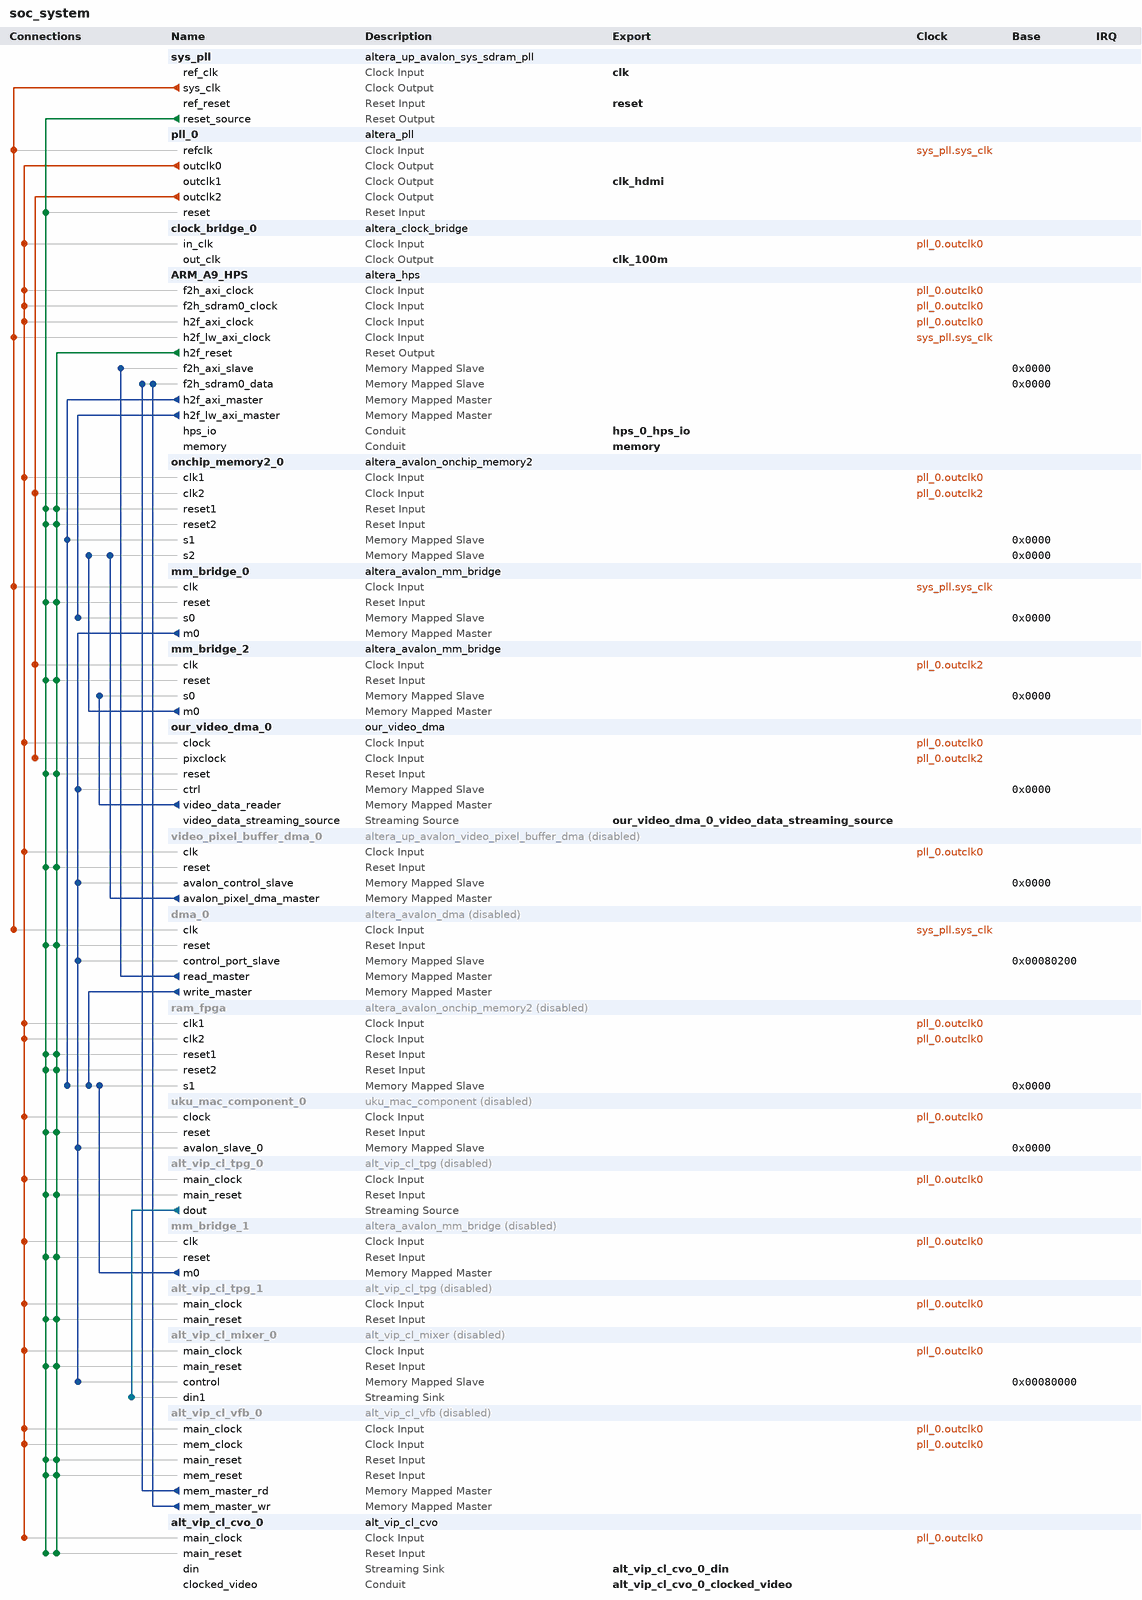
[diagram p0: system contents]
# Platform Designer (Qsys) system soc_system, Cyclone V 5CSEBA6U23I7
# Parameters at their usual value, and those the tool derives, are not listed.
package require -exact qsys 20.1
create_system soc_system
set_project_property DEVICE_FAMILY {Cyclone V}
set_project_property DEVICE 5CSEBA6U23I7

add_instance sys_pll altera_up_avalon_sys_sdram_pll 18.0
set_instance_parameter_value sys_pll CV_boards DE10-Nano
set_instance_parameter_value sys_pll gui_outclk 50.0
set_instance_parameter_value sys_pll gui_refclk 50.0

add_instance pll_0 altera_pll 20.1
set_instance_parameter_value pll_0 gui_actual_output_clock_frequency1 {107.692307 MHz}
set_instance_parameter_value pll_0 gui_device_speed_grade 1
set_instance_parameter_value pll_0 gui_number_of_clocks 3
set_instance_parameter_value pll_0 gui_operation_mode direct
set_instance_parameter_value pll_0 gui_output_clock_frequency0 130.0
set_instance_parameter_value pll_0 gui_output_clock_frequency1 65.0
set_instance_parameter_value pll_0 gui_output_clock_frequency2 65.0
set_instance_parameter_value pll_0 gui_pll_mode {Integer-N PLL}
set_instance_parameter_value pll_0 gui_reference_clock_frequency 50.0
set_instance_parameter_value pll_0 gui_use_locked false

add_instance clock_bridge_0 altera_clock_bridge 20.1
set_instance_parameter_value clock_bridge_0 DERIVED_CLOCK_RATE 130000000
set_instance_parameter_value clock_bridge_0 EXPLICIT_CLOCK_RATE 0

add_instance ARM_A9_HPS altera_hps 20.1
set_instance_parameter_value ARM_A9_HPS EMAC1_Mode RGMII
set_instance_parameter_value ARM_A9_HPS EMAC1_PinMuxing {HPS I/O Set 0}
set_instance_parameter_value ARM_A9_HPS F2SCLK_COLDRST_Enable false
set_instance_parameter_value ARM_A9_HPS F2SCLK_DBGRST_Enable false
set_instance_parameter_value ARM_A9_HPS F2SCLK_WARMRST_Enable false
set_instance_parameter_value ARM_A9_HPS F2SDRAM_Type {Avalon-MM Bidirectional}
set_instance_parameter_value ARM_A9_HPS F2SDRAM_Width 128
set_instance_parameter_value ARM_A9_HPS F2SINTERRUPT_Enable true
set_instance_parameter_value ARM_A9_HPS F2S_Width 1
set_instance_parameter_value ARM_A9_HPS FPGA_PERIPHERAL_OUTPUT_CLOCK_FREQ_EMAC0_GTX_CLK 100
set_instance_parameter_value ARM_A9_HPS FPGA_PERIPHERAL_OUTPUT_CLOCK_FREQ_EMAC0_MD_CLK 100.0
set_instance_parameter_value ARM_A9_HPS FPGA_PERIPHERAL_OUTPUT_CLOCK_FREQ_EMAC1_GTX_CLK 100
set_instance_parameter_value ARM_A9_HPS FPGA_PERIPHERAL_OUTPUT_CLOCK_FREQ_EMAC1_MD_CLK 100.0
set_instance_parameter_value ARM_A9_HPS HPS_PROTOCOL DDR3
set_instance_parameter_value ARM_A9_HPS I2C0_Mode I2C
set_instance_parameter_value ARM_A9_HPS I2C0_PinMuxing {HPS I/O Set 0}
set_instance_parameter_value ARM_A9_HPS I2C1_Mode I2C
set_instance_parameter_value ARM_A9_HPS I2C1_PinMuxing {HPS I/O Set 0}
set_instance_parameter_value ARM_A9_HPS LWH2F_Enable true
set_instance_parameter_value ARM_A9_HPS MEM_BANKADDR_WIDTH 3
set_instance_parameter_value ARM_A9_HPS MEM_CLK_FREQ 400.0
set_instance_parameter_value ARM_A9_HPS MEM_COL_ADDR_WIDTH 10
set_instance_parameter_value ARM_A9_HPS MEM_DQ_WIDTH 32
set_instance_parameter_value ARM_A9_HPS MEM_DRV_STR RZQ/6
set_instance_parameter_value ARM_A9_HPS MEM_ROW_ADDR_WIDTH 15
set_instance_parameter_value ARM_A9_HPS MEM_RTT_NOM RZQ/6
set_instance_parameter_value ARM_A9_HPS MEM_RTT_WR {Dynamic ODT off}
set_instance_parameter_value ARM_A9_HPS MEM_TCL 7
set_instance_parameter_value ARM_A9_HPS MEM_TFAW_NS 37.5
set_instance_parameter_value ARM_A9_HPS MEM_TRAS_NS 35.0
set_instance_parameter_value ARM_A9_HPS MEM_TRCD_NS 13.75
set_instance_parameter_value ARM_A9_HPS MEM_TRFC_NS 300.0
set_instance_parameter_value ARM_A9_HPS MEM_TRP_NS 13.75
set_instance_parameter_value ARM_A9_HPS MEM_VENDOR Other
set_instance_parameter_value ARM_A9_HPS MEM_WTCL 7
set_instance_parameter_value ARM_A9_HPS QSPI_Mode N/A
set_instance_parameter_value ARM_A9_HPS QSPI_PinMuxing Unused
set_instance_parameter_value ARM_A9_HPS REF_CLK_FREQ 25.0
set_instance_parameter_value ARM_A9_HPS S2FCLK_USER2CLK 4
set_instance_parameter_value ARM_A9_HPS S2F_Width 1
set_instance_parameter_value ARM_A9_HPS SDIO_Mode {4-bit Data}
set_instance_parameter_value ARM_A9_HPS SDIO_PinMuxing {HPS I/O Set 0}
set_instance_parameter_value ARM_A9_HPS SPIM1_Mode {Single Slave Select}
set_instance_parameter_value ARM_A9_HPS SPIM1_PinMuxing {HPS I/O Set 0}
set_instance_parameter_value ARM_A9_HPS STM_Enable false
set_instance_parameter_value ARM_A9_HPS TIMING_BOARD_AC_SKEW 0.02
set_instance_parameter_value ARM_A9_HPS TIMING_BOARD_AC_TO_CK_SKEW 0.0
set_instance_parameter_value ARM_A9_HPS TIMING_BOARD_DQ_TO_DQS_SKEW 0.0
set_instance_parameter_value ARM_A9_HPS TIMING_BOARD_MAX_CK_DELAY 0.6
set_instance_parameter_value ARM_A9_HPS TIMING_BOARD_MAX_DQS_DELAY 0.6
set_instance_parameter_value ARM_A9_HPS TIMING_BOARD_SKEW_BETWEEN_DQS 0.02
set_instance_parameter_value ARM_A9_HPS TIMING_BOARD_SKEW_CKDQS_DIMM_MAX 0.01
set_instance_parameter_value ARM_A9_HPS TIMING_BOARD_SKEW_CKDQS_DIMM_MIN -0.01
set_instance_parameter_value ARM_A9_HPS TIMING_BOARD_SKEW_WITHIN_DQS 0.02
set_instance_parameter_value ARM_A9_HPS TIMING_TDH 125
set_instance_parameter_value ARM_A9_HPS TIMING_TDQSCK 400
set_instance_parameter_value ARM_A9_HPS TIMING_TDQSQ 120
set_instance_parameter_value ARM_A9_HPS TIMING_TDS 50
set_instance_parameter_value ARM_A9_HPS TIMING_TIH 250
set_instance_parameter_value ARM_A9_HPS TIMING_TIS 175
set_instance_parameter_value ARM_A9_HPS TIMING_TQSH 0.38
set_instance_parameter_value ARM_A9_HPS UART0_Mode {No Flow Control}
set_instance_parameter_value ARM_A9_HPS UART0_PinMuxing {HPS I/O Set 0}
set_instance_parameter_value ARM_A9_HPS USB1_Mode SDR
set_instance_parameter_value ARM_A9_HPS USB1_PinMuxing {HPS I/O Set 0}
set_instance_parameter_value ARM_A9_HPS desired_cfg_clk_mhz 100.0
set_instance_parameter_value ARM_A9_HPS desired_qspi_clk_mhz 370.0

add_instance onchip_memory2_0 altera_avalon_onchip_memory2 20.1
set_instance_parameter_value onchip_memory2_0 dataWidth 32
set_instance_parameter_value onchip_memory2_0 dualPort true
set_instance_parameter_value onchip_memory2_0 initMemContent true
set_instance_parameter_value onchip_memory2_0 initializationFileName onchip_mem.hex
set_instance_parameter_value onchip_memory2_0 memorySize 24576

add_instance mm_bridge_0 altera_avalon_mm_bridge 20.1
set_instance_parameter_value mm_bridge_0 ADDRESS_UNITS SYMBOLS
set_instance_parameter_value mm_bridge_0 ADDRESS_WIDTH 10
set_instance_parameter_value mm_bridge_0 DATA_WIDTH 32
set_instance_parameter_value mm_bridge_0 MAX_PENDING_RESPONSES 4
set_instance_parameter_value mm_bridge_0 USE_AUTO_ADDRESS_WIDTH 1

add_instance mm_bridge_2 altera_avalon_mm_bridge 20.1
set_instance_parameter_value mm_bridge_2 ADDRESS_UNITS WORDS
set_instance_parameter_value mm_bridge_2 ADDRESS_WIDTH 32
set_instance_parameter_value mm_bridge_2 DATA_WIDTH 32
set_instance_parameter_value mm_bridge_2 MAX_PENDING_RESPONSES 1
set_instance_parameter_value mm_bridge_2 PIPELINE_COMMAND 0
set_instance_parameter_value mm_bridge_2 PIPELINE_RESPONSE 0
set_instance_parameter_value mm_bridge_2 USE_AUTO_ADDRESS_WIDTH 1

add_instance our_video_dma_0 our_video_dma 1.0
set_instance_parameter_value our_video_dma_0 VIDEO_H 768
set_instance_parameter_value our_video_dma_0 VIDEO_W 1025

add_instance video_pixel_buffer_dma_0 altera_up_avalon_video_pixel_buffer_dma 18.0
set_instance_property video_pixel_buffer_dma_0 ENABLED false
set_instance_parameter_value video_pixel_buffer_dma_0 addr_mode Consecutive
set_instance_parameter_value video_pixel_buffer_dma_0 back_start_address 0
set_instance_parameter_value video_pixel_buffer_dma_0 color_space {24-bit RGB}
set_instance_parameter_value video_pixel_buffer_dma_0 image_height 768
set_instance_parameter_value video_pixel_buffer_dma_0 image_width 1024
set_instance_parameter_value video_pixel_buffer_dma_0 start_address 0

add_instance dma_0 altera_avalon_dma 20.1
set_instance_property dma_0 ENABLED false
set_instance_parameter_value dma_0 allowByteTransactions false
set_instance_parameter_value dma_0 allowDoubleWordTransactions false
set_instance_parameter_value dma_0 allowHalfWordTransactions false
set_instance_parameter_value dma_0 allowQuadWordTransactions false
set_instance_parameter_value dma_0 burstEnable false
set_instance_parameter_value dma_0 fifoDepth 32
set_instance_parameter_value dma_0 maxBurstSize 128
set_instance_parameter_value dma_0 minimumDmaTransactionRegisterWidth 16

add_instance ram_fpga altera_avalon_onchip_memory2 20.1
set_instance_property ram_fpga ENABLED false
set_instance_parameter_value ram_fpga dataWidth 32
set_instance_parameter_value ram_fpga dualPort true
set_instance_parameter_value ram_fpga initMemContent true
set_instance_parameter_value ram_fpga initializationFileName onchip_mem.hex
set_instance_parameter_value ram_fpga memorySize 100000

add_instance uku_mac_component_0 uku_mac_component 1.0
set_instance_property uku_mac_component_0 ENABLED false

add_instance alt_vip_cl_tpg_0 alt_vip_cl_tpg 20.1
set_instance_property alt_vip_cl_tpg_0 ENABLED false
set_instance_parameter_value alt_vip_cl_tpg_0 BITS_PER_SYMBOL 8
set_instance_parameter_value alt_vip_cl_tpg_0 COLOR_PLANES_ARE_IN_PARALLEL 1
set_instance_parameter_value alt_vip_cl_tpg_0 COLOR_SPACE_0 RGB_444
set_instance_parameter_value alt_vip_cl_tpg_0 COLOR_SPACE_1 RGB_444
set_instance_parameter_value alt_vip_cl_tpg_0 COLOR_SPACE_2 RGB_444
set_instance_parameter_value alt_vip_cl_tpg_0 COLOR_SPACE_3 RGB_444
set_instance_parameter_value alt_vip_cl_tpg_0 COLOR_SPACE_4 RGB_444
set_instance_parameter_value alt_vip_cl_tpg_0 COLOR_SPACE_5 RGB_444
set_instance_parameter_value alt_vip_cl_tpg_0 COLOR_SPACE_6 RGB_444
set_instance_parameter_value alt_vip_cl_tpg_0 COLOR_SPACE_7 RGB_444
set_instance_parameter_value alt_vip_cl_tpg_0 DEFAULT_BOARDER 1
set_instance_parameter_value alt_vip_cl_tpg_0 FAMILY {Cyclone V}
set_instance_parameter_value alt_vip_cl_tpg_0 INTERLACING PROGRESSIVE
set_instance_parameter_value alt_vip_cl_tpg_0 LIMITED_READBACK 0
set_instance_parameter_value alt_vip_cl_tpg_0 MAX_HEIGHT 768
set_instance_parameter_value alt_vip_cl_tpg_0 MAX_WIDTH 1024
set_instance_parameter_value alt_vip_cl_tpg_0 NUMBER_OF_COLOR_PLANES 2
set_instance_parameter_value alt_vip_cl_tpg_0 NUM_CORES 1
set_instance_parameter_value alt_vip_cl_tpg_0 OUTPUT_FORMAT 4.4.4
set_instance_parameter_value alt_vip_cl_tpg_0 PATTERN_0 colorbars
set_instance_parameter_value alt_vip_cl_tpg_0 PATTERN_1 colorbars
set_instance_parameter_value alt_vip_cl_tpg_0 PATTERN_2 colorbars
set_instance_parameter_value alt_vip_cl_tpg_0 PATTERN_3 colorbars
set_instance_parameter_value alt_vip_cl_tpg_0 PATTERN_4 colorbars
set_instance_parameter_value alt_vip_cl_tpg_0 PATTERN_5 colorbars
set_instance_parameter_value alt_vip_cl_tpg_0 PATTERN_6 colorbars
set_instance_parameter_value alt_vip_cl_tpg_0 PATTERN_7 colorbars
set_instance_parameter_value alt_vip_cl_tpg_0 PIPELINE_READY 0
set_instance_parameter_value alt_vip_cl_tpg_0 PIXELS_IN_PARALLEL 1
set_instance_parameter_value alt_vip_cl_tpg_0 RUNTIME_CONTROL 0
set_instance_parameter_value alt_vip_cl_tpg_0 UNIFORM_VALUE_BCR 16
set_instance_parameter_value alt_vip_cl_tpg_0 UNIFORM_VALUE_GCB 16
set_instance_parameter_value alt_vip_cl_tpg_0 UNIFORM_VALUE_RY 16

add_instance mm_bridge_1 altera_avalon_mm_bridge 20.1
set_instance_property mm_bridge_1 ENABLED false
set_instance_parameter_value mm_bridge_1 ADDRESS_UNITS SYMBOLS
set_instance_parameter_value mm_bridge_1 ADDRESS_WIDTH 32
set_instance_parameter_value mm_bridge_1 DATA_WIDTH 32
set_instance_parameter_value mm_bridge_1 MAX_PENDING_RESPONSES 4
set_instance_parameter_value mm_bridge_1 USE_AUTO_ADDRESS_WIDTH 0

add_instance alt_vip_cl_tpg_1 alt_vip_cl_tpg 20.1
set_instance_property alt_vip_cl_tpg_1 ENABLED false
set_instance_parameter_value alt_vip_cl_tpg_1 BITS_PER_SYMBOL 8
set_instance_parameter_value alt_vip_cl_tpg_1 COLOR_PLANES_ARE_IN_PARALLEL 1
set_instance_parameter_value alt_vip_cl_tpg_1 COLOR_SPACE_0 RGB_444
set_instance_parameter_value alt_vip_cl_tpg_1 COLOR_SPACE_1 RGB_444
set_instance_parameter_value alt_vip_cl_tpg_1 COLOR_SPACE_2 RGB_444
set_instance_parameter_value alt_vip_cl_tpg_1 COLOR_SPACE_3 RGB_444
set_instance_parameter_value alt_vip_cl_tpg_1 COLOR_SPACE_4 RGB_444
set_instance_parameter_value alt_vip_cl_tpg_1 COLOR_SPACE_5 RGB_444
set_instance_parameter_value alt_vip_cl_tpg_1 COLOR_SPACE_6 RGB_444
set_instance_parameter_value alt_vip_cl_tpg_1 COLOR_SPACE_7 RGB_444
set_instance_parameter_value alt_vip_cl_tpg_1 DEFAULT_BOARDER 1
set_instance_parameter_value alt_vip_cl_tpg_1 FAMILY {Cyclone V}
set_instance_parameter_value alt_vip_cl_tpg_1 INTERLACING PROGRESSIVE
set_instance_parameter_value alt_vip_cl_tpg_1 LIMITED_READBACK 0
set_instance_parameter_value alt_vip_cl_tpg_1 MAX_HEIGHT 100
set_instance_parameter_value alt_vip_cl_tpg_1 MAX_WIDTH 200
set_instance_parameter_value alt_vip_cl_tpg_1 NUMBER_OF_COLOR_PLANES 2
set_instance_parameter_value alt_vip_cl_tpg_1 NUM_CORES 1
set_instance_parameter_value alt_vip_cl_tpg_1 OUTPUT_FORMAT 4.4.4
set_instance_parameter_value alt_vip_cl_tpg_1 PATTERN_0 uniform
set_instance_parameter_value alt_vip_cl_tpg_1 PATTERN_1 colorbars
set_instance_parameter_value alt_vip_cl_tpg_1 PATTERN_2 colorbars
set_instance_parameter_value alt_vip_cl_tpg_1 PATTERN_3 colorbars
set_instance_parameter_value alt_vip_cl_tpg_1 PATTERN_4 colorbars
set_instance_parameter_value alt_vip_cl_tpg_1 PATTERN_5 colorbars
set_instance_parameter_value alt_vip_cl_tpg_1 PATTERN_6 colorbars
set_instance_parameter_value alt_vip_cl_tpg_1 PATTERN_7 colorbars
set_instance_parameter_value alt_vip_cl_tpg_1 PIPELINE_READY 0
set_instance_parameter_value alt_vip_cl_tpg_1 PIXELS_IN_PARALLEL 1
set_instance_parameter_value alt_vip_cl_tpg_1 RUNTIME_CONTROL 0
set_instance_parameter_value alt_vip_cl_tpg_1 UNIFORM_VALUE_BCR 120
set_instance_parameter_value alt_vip_cl_tpg_1 UNIFORM_VALUE_GCB 255
set_instance_parameter_value alt_vip_cl_tpg_1 UNIFORM_VALUE_RY 8

add_instance alt_vip_cl_mixer_0 alt_vip_cl_mixer 20.1
set_instance_property alt_vip_cl_mixer_0 ENABLED false
set_instance_parameter_value alt_vip_cl_mixer_0 ALPHA_ENABLE 0
set_instance_parameter_value alt_vip_cl_mixer_0 ALPHA_STREAM_ENABLE0 0
set_instance_parameter_value alt_vip_cl_mixer_0 ALPHA_STREAM_ENABLE1 0
set_instance_parameter_value alt_vip_cl_mixer_0 ALPHA_STREAM_ENABLE10 0
set_instance_parameter_value alt_vip_cl_mixer_0 ALPHA_STREAM_ENABLE11 0
set_instance_parameter_value alt_vip_cl_mixer_0 ALPHA_STREAM_ENABLE12 0
set_instance_parameter_value alt_vip_cl_mixer_0 ALPHA_STREAM_ENABLE13 0
set_instance_parameter_value alt_vip_cl_mixer_0 ALPHA_STREAM_ENABLE14 0
set_instance_parameter_value alt_vip_cl_mixer_0 ALPHA_STREAM_ENABLE15 0
set_instance_parameter_value alt_vip_cl_mixer_0 ALPHA_STREAM_ENABLE16 0
set_instance_parameter_value alt_vip_cl_mixer_0 ALPHA_STREAM_ENABLE17 0
set_instance_parameter_value alt_vip_cl_mixer_0 ALPHA_STREAM_ENABLE18 0
set_instance_parameter_value alt_vip_cl_mixer_0 ALPHA_STREAM_ENABLE19 0
set_instance_parameter_value alt_vip_cl_mixer_0 ALPHA_STREAM_ENABLE2 0
set_instance_parameter_value alt_vip_cl_mixer_0 ALPHA_STREAM_ENABLE3 0
set_instance_parameter_value alt_vip_cl_mixer_0 ALPHA_STREAM_ENABLE4 0
set_instance_parameter_value alt_vip_cl_mixer_0 ALPHA_STREAM_ENABLE5 0
set_instance_parameter_value alt_vip_cl_mixer_0 ALPHA_STREAM_ENABLE6 0
set_instance_parameter_value alt_vip_cl_mixer_0 ALPHA_STREAM_ENABLE7 0
set_instance_parameter_value alt_vip_cl_mixer_0 ALPHA_STREAM_ENABLE8 0
set_instance_parameter_value alt_vip_cl_mixer_0 ALPHA_STREAM_ENABLE9 0
set_instance_parameter_value alt_vip_cl_mixer_0 BITS_PER_SYMBOL 8
set_instance_parameter_value alt_vip_cl_mixer_0 COLOR_PLANES_ARE_IN_PARALLEL 1
set_instance_parameter_value alt_vip_cl_mixer_0 COLOR_SPACE RGB
set_instance_parameter_value alt_vip_cl_mixer_0 DATA_PIPELINE_STAGES 0
set_instance_parameter_value alt_vip_cl_mixer_0 FAMILY {Cyclone V}
set_instance_parameter_value alt_vip_cl_mixer_0 IS_422 1
set_instance_parameter_value alt_vip_cl_mixer_0 LAYER_POSITION_ENABLE 0
set_instance_parameter_value alt_vip_cl_mixer_0 LIMITED_READBACK 0
set_instance_parameter_value alt_vip_cl_mixer_0 LOW_LATENCY_MODE 0
set_instance_parameter_value alt_vip_cl_mixer_0 MAX_HEIGHT 768
set_instance_parameter_value alt_vip_cl_mixer_0 MAX_WIDTH 1024
set_instance_parameter_value alt_vip_cl_mixer_0 NO_OF_INPUTS 2
set_instance_parameter_value alt_vip_cl_mixer_0 NUMBER_OF_COLOR_PLANES 2
set_instance_parameter_value alt_vip_cl_mixer_0 PATTERN uniform
set_instance_parameter_value alt_vip_cl_mixer_0 PIPELINE_READY 0
set_instance_parameter_value alt_vip_cl_mixer_0 PIXELS_IN_PARALLEL 1
set_instance_parameter_value alt_vip_cl_mixer_0 UNIFORM_VALUE_BCR 30
set_instance_parameter_value alt_vip_cl_mixer_0 UNIFORM_VALUE_GCB 30
set_instance_parameter_value alt_vip_cl_mixer_0 UNIFORM_VALUE_RY 200
set_instance_parameter_value alt_vip_cl_mixer_0 USER_PACKET_FIFO_DEPTH 0
set_instance_parameter_value alt_vip_cl_mixer_0 USER_PACKET_SUPPORT DISCARD

add_instance alt_vip_cl_vfb_0 alt_vip_cl_vfb 20.1
set_instance_property alt_vip_cl_vfb_0 ENABLED false
set_instance_parameter_value alt_vip_cl_vfb_0 CLOCKS_ARE_SEPARATE 1
set_instance_parameter_value alt_vip_cl_vfb_0 DROP_FRAMES 1
set_instance_parameter_value alt_vip_cl_vfb_0 DROP_INVALID_FIELDS 1
set_instance_parameter_value alt_vip_cl_vfb_0 DROP_REPEAT_USER 0
set_instance_parameter_value alt_vip_cl_vfb_0 IS_FRAME_READER 0
set_instance_parameter_value alt_vip_cl_vfb_0 LINE_BASED_BUFFERING 0
set_instance_parameter_value alt_vip_cl_vfb_0 MAX_HEIGHT 1080
set_instance_parameter_value alt_vip_cl_vfb_0 MAX_WIDTH 1920
set_instance_parameter_value alt_vip_cl_vfb_0 MEM_BASE_ADDR 553648128
set_instance_parameter_value alt_vip_cl_vfb_0 MEM_BUFFER_OFFSET 16777216
set_instance_parameter_value alt_vip_cl_vfb_0 MEM_PORT_WIDTH 128
set_instance_parameter_value alt_vip_cl_vfb_0 PRIORITIZE_FMAX 0
set_instance_parameter_value alt_vip_cl_vfb_0 READER_RUNTIME_CONTROL 0
set_instance_parameter_value alt_vip_cl_vfb_0 READ_FIFO_DEPTH 512
set_instance_parameter_value alt_vip_cl_vfb_0 USER_PACKETS_MAX_STORAGE 1
set_instance_parameter_value alt_vip_cl_vfb_0 USE_BUFFER_OFFSET 0
set_instance_parameter_value alt_vip_cl_vfb_0 WRITE_BURST_TARGET 32
set_instance_parameter_value alt_vip_cl_vfb_0 WRITE_FIFO_DEPTH 512

add_instance alt_vip_cl_cvo_0 alt_vip_cl_cvo 20.1
set_instance_parameter_value alt_vip_cl_cvo_0 ACCEPT_COLOURS_IN_SEQ 0
set_instance_parameter_value alt_vip_cl_cvo_0 ACCEPT_SYNC 0
set_instance_parameter_value alt_vip_cl_cvo_0 ANC_LINE 0
set_instance_parameter_value alt_vip_cl_cvo_0 AP_LINE 0
set_instance_parameter_value alt_vip_cl_cvo_0 BPS 8
set_instance_parameter_value alt_vip_cl_cvo_0 CLOCKS_ARE_SAME 0
set_instance_parameter_value alt_vip_cl_cvo_0 COLOUR_PLANES_ARE_IN_PARALLEL 1
set_instance_parameter_value alt_vip_cl_cvo_0 CONTEXT_WIDTH 8
set_instance_parameter_value alt_vip_cl_cvo_0 COUNT_STEP_IS_PIP_VALUE 0
set_instance_parameter_value alt_vip_cl_cvo_0 DST_WIDTH 8
set_instance_parameter_value alt_vip_cl_cvo_0 FIELD0_ANC_LINE 0
set_instance_parameter_value alt_vip_cl_cvo_0 FIELD0_V_BACK_PORCH 0
set_instance_parameter_value alt_vip_cl_cvo_0 FIELD0_V_BLANK 0
set_instance_parameter_value alt_vip_cl_cvo_0 FIELD0_V_FRONT_PORCH 0
set_instance_parameter_value alt_vip_cl_cvo_0 FIELD0_V_RISING_EDGE 0
set_instance_parameter_value alt_vip_cl_cvo_0 FIELD0_V_SYNC_LENGTH 0
set_instance_parameter_value alt_vip_cl_cvo_0 FIFO_DEPTH 4000
set_instance_parameter_value alt_vip_cl_cvo_0 F_FALLING_EDGE 0
set_instance_parameter_value alt_vip_cl_cvo_0 F_RISING_EDGE 0
set_instance_parameter_value alt_vip_cl_cvo_0 GENERATE_SYNC 0
set_instance_parameter_value alt_vip_cl_cvo_0 H_ACTIVE_PIXELS 1024
set_instance_parameter_value alt_vip_cl_cvo_0 H_BACK_PORCH 160
set_instance_parameter_value alt_vip_cl_cvo_0 H_BLANK 0
set_instance_parameter_value alt_vip_cl_cvo_0 H_FRONT_PORCH 24
set_instance_parameter_value alt_vip_cl_cvo_0 H_SYNC_LENGTH 136
set_instance_parameter_value alt_vip_cl_cvo_0 INTERLACED 0
set_instance_parameter_value alt_vip_cl_cvo_0 LOW_LATENCY 0
set_instance_parameter_value alt_vip_cl_cvo_0 NO_OF_CHANNELS 1
set_instance_parameter_value alt_vip_cl_cvo_0 NO_OF_MODES 1
set_instance_parameter_value alt_vip_cl_cvo_0 NUMBER_OF_COLOUR_PLANES 3
set_instance_parameter_value alt_vip_cl_cvo_0 PIXELS_IN_PARALLEL 1
set_instance_parameter_value alt_vip_cl_cvo_0 SRC_WIDTH 8
set_instance_parameter_value alt_vip_cl_cvo_0 STD_WIDTH 1
set_instance_parameter_value alt_vip_cl_cvo_0 TASK_WIDTH 8
set_instance_parameter_value alt_vip_cl_cvo_0 THRESHOLD 3999
set_instance_parameter_value alt_vip_cl_cvo_0 USE_CONTROL 0
set_instance_parameter_value alt_vip_cl_cvo_0 USE_EMBEDDED_SYNCS 0
set_instance_parameter_value alt_vip_cl_cvo_0 V_ACTIVE_LINES 768
set_instance_parameter_value alt_vip_cl_cvo_0 V_BACK_PORCH 29
set_instance_parameter_value alt_vip_cl_cvo_0 V_BLANK 0
set_instance_parameter_value alt_vip_cl_cvo_0 V_FRONT_PORCH 3
set_instance_parameter_value alt_vip_cl_cvo_0 V_SYNC_LENGTH 6

# connections
add_connection pll_0.outclk0 alt_vip_cl_cvo_0.main_clock clock
add_connection pll_0.outclk0 alt_vip_cl_mixer_0.main_clock clock
add_connection pll_0.outclk0 alt_vip_cl_tpg_0.main_clock clock
add_connection pll_0.outclk0 alt_vip_cl_tpg_1.main_clock clock
add_connection pll_0.outclk0 alt_vip_cl_vfb_0.main_clock clock
add_connection pll_0.outclk0 alt_vip_cl_vfb_0.mem_clock clock
add_connection pll_0.outclk0 ARM_A9_HPS.f2h_axi_clock clock
add_connection pll_0.outclk0 ARM_A9_HPS.f2h_sdram0_clock clock
add_connection pll_0.outclk0 ARM_A9_HPS.h2f_axi_clock clock
add_connection pll_0.outclk0 clock_bridge_0.in_clk clock
add_connection pll_0.outclk0 mm_bridge_1.clk clock
add_connection pll_0.outclk0 onchip_memory2_0.clk1 clock
add_connection pll_0.outclk0 our_video_dma_0.clock clock
add_connection pll_0.outclk0 ram_fpga.clk1 clock
add_connection pll_0.outclk0 ram_fpga.clk2 clock
add_connection pll_0.outclk0 uku_mac_component_0.clock clock
add_connection pll_0.outclk0 video_pixel_buffer_dma_0.clk clock
add_connection pll_0.outclk2 mm_bridge_2.clk clock
add_connection pll_0.outclk2 onchip_memory2_0.clk2 clock
add_connection pll_0.outclk2 our_video_dma_0.pixclock clock
add_connection sys_pll.sys_clk ARM_A9_HPS.h2f_lw_axi_clock clock
add_connection sys_pll.sys_clk dma_0.clk clock
add_connection sys_pll.sys_clk mm_bridge_0.clk clock
add_connection sys_pll.sys_clk pll_0.refclk clock
add_connection ARM_A9_HPS.h2f_reset alt_vip_cl_cvo_0.main_reset reset
add_connection ARM_A9_HPS.h2f_reset alt_vip_cl_mixer_0.main_reset reset
add_connection ARM_A9_HPS.h2f_reset alt_vip_cl_tpg_0.main_reset reset
add_connection ARM_A9_HPS.h2f_reset alt_vip_cl_tpg_1.main_reset reset
add_connection ARM_A9_HPS.h2f_reset alt_vip_cl_vfb_0.main_reset reset
add_connection ARM_A9_HPS.h2f_reset alt_vip_cl_vfb_0.mem_reset reset
add_connection ARM_A9_HPS.h2f_reset dma_0.reset reset
add_connection ARM_A9_HPS.h2f_reset mm_bridge_0.reset reset
add_connection ARM_A9_HPS.h2f_reset mm_bridge_1.reset reset
add_connection ARM_A9_HPS.h2f_reset mm_bridge_2.reset reset
add_connection ARM_A9_HPS.h2f_reset onchip_memory2_0.reset1 reset
add_connection ARM_A9_HPS.h2f_reset onchip_memory2_0.reset2 reset
add_connection ARM_A9_HPS.h2f_reset our_video_dma_0.reset reset
add_connection ARM_A9_HPS.h2f_reset ram_fpga.reset1 reset
add_connection ARM_A9_HPS.h2f_reset ram_fpga.reset2 reset
add_connection ARM_A9_HPS.h2f_reset uku_mac_component_0.reset reset
add_connection ARM_A9_HPS.h2f_reset video_pixel_buffer_dma_0.reset reset
add_connection sys_pll.reset_source alt_vip_cl_cvo_0.main_reset reset
add_connection sys_pll.reset_source alt_vip_cl_mixer_0.main_reset reset
add_connection sys_pll.reset_source alt_vip_cl_tpg_0.main_reset reset
add_connection sys_pll.reset_source alt_vip_cl_tpg_1.main_reset reset
add_connection sys_pll.reset_source alt_vip_cl_vfb_0.main_reset reset
add_connection sys_pll.reset_source alt_vip_cl_vfb_0.mem_reset reset
add_connection sys_pll.reset_source dma_0.reset reset
add_connection sys_pll.reset_source mm_bridge_0.reset reset
add_connection sys_pll.reset_source mm_bridge_1.reset reset
add_connection sys_pll.reset_source mm_bridge_2.reset reset
add_connection sys_pll.reset_source onchip_memory2_0.reset1 reset
add_connection sys_pll.reset_source onchip_memory2_0.reset2 reset
add_connection sys_pll.reset_source our_video_dma_0.reset reset
add_connection sys_pll.reset_source pll_0.reset reset
add_connection sys_pll.reset_source ram_fpga.reset1 reset
add_connection sys_pll.reset_source ram_fpga.reset2 reset
add_connection sys_pll.reset_source uku_mac_component_0.reset reset
add_connection sys_pll.reset_source video_pixel_buffer_dma_0.reset reset
add_connection alt_vip_cl_vfb_0.mem_master_rd ARM_A9_HPS.f2h_sdram0_data avalon
set_connection_parameter_value alt_vip_cl_vfb_0.mem_master_rd/ARM_A9_HPS.f2h_sdram0_data baseAddress 0x0000
add_connection alt_vip_cl_vfb_0.mem_master_wr ARM_A9_HPS.f2h_sdram0_data avalon
set_connection_parameter_value alt_vip_cl_vfb_0.mem_master_wr/ARM_A9_HPS.f2h_sdram0_data baseAddress 0x0000
add_connection ARM_A9_HPS.h2f_axi_master onchip_memory2_0.s1 avalon
set_connection_parameter_value ARM_A9_HPS.h2f_axi_master/onchip_memory2_0.s1 baseAddress 0x0000
add_connection ARM_A9_HPS.h2f_axi_master ram_fpga.s1 avalon
set_connection_parameter_value ARM_A9_HPS.h2f_axi_master/ram_fpga.s1 baseAddress 0x0000
add_connection ARM_A9_HPS.h2f_lw_axi_master mm_bridge_0.s0 avalon
set_connection_parameter_value ARM_A9_HPS.h2f_lw_axi_master/mm_bridge_0.s0 baseAddress 0x0000
add_connection dma_0.read_master ARM_A9_HPS.f2h_axi_slave avalon
set_connection_parameter_value dma_0.read_master/ARM_A9_HPS.f2h_axi_slave baseAddress 0x0000
add_connection dma_0.write_master ram_fpga.s1 avalon
set_connection_parameter_value dma_0.write_master/ram_fpga.s1 baseAddress 0x0000
add_connection mm_bridge_0.m0 alt_vip_cl_mixer_0.control avalon
set_connection_parameter_value mm_bridge_0.m0/alt_vip_cl_mixer_0.control baseAddress 0x00080000
add_connection mm_bridge_0.m0 dma_0.control_port_slave avalon
set_connection_parameter_value mm_bridge_0.m0/dma_0.control_port_slave baseAddress 0x00080200
add_connection mm_bridge_0.m0 our_video_dma_0.ctrl avalon
set_connection_parameter_value mm_bridge_0.m0/our_video_dma_0.ctrl baseAddress 0x0000
add_connection mm_bridge_0.m0 uku_mac_component_0.avalon_slave_0 avalon
set_connection_parameter_value mm_bridge_0.m0/uku_mac_component_0.avalon_slave_0 baseAddress 0x0000
add_connection mm_bridge_0.m0 video_pixel_buffer_dma_0.avalon_control_slave avalon
set_connection_parameter_value mm_bridge_0.m0/video_pixel_buffer_dma_0.avalon_control_slave baseAddress 0x0000
add_connection mm_bridge_1.m0 ram_fpga.s1 avalon
set_connection_parameter_value mm_bridge_1.m0/ram_fpga.s1 baseAddress 0x0000
add_connection mm_bridge_2.m0 onchip_memory2_0.s2 avalon
set_connection_parameter_value mm_bridge_2.m0/onchip_memory2_0.s2 baseAddress 0x0000
add_connection our_video_dma_0.video_data_reader mm_bridge_2.s0 avalon
set_connection_parameter_value our_video_dma_0.video_data_reader/mm_bridge_2.s0 baseAddress 0x0000
add_connection video_pixel_buffer_dma_0.avalon_pixel_dma_master onchip_memory2_0.s2 avalon
set_connection_parameter_value video_pixel_buffer_dma_0.avalon_pixel_dma_master/onchip_memory2_0.s2 baseAddress 0x0000
add_connection alt_vip_cl_tpg_0.dout alt_vip_cl_mixer_0.din1 avalon_streaming

# exported interfaces
add_interface alt_vip_cl_cvo_0_clocked_video conduit end
set_interface_property alt_vip_cl_cvo_0_clocked_video EXPORT_OF alt_vip_cl_cvo_0.clocked_video
add_interface alt_vip_cl_cvo_0_din avalon_streaming sink
set_interface_property alt_vip_cl_cvo_0_din EXPORT_OF alt_vip_cl_cvo_0.din
add_interface clk clock sink
set_interface_property clk EXPORT_OF sys_pll.ref_clk
add_interface clk_100m clock source
set_interface_property clk_100m EXPORT_OF clock_bridge_0.out_clk
add_interface clk_hdmi clock source
set_interface_property clk_hdmi EXPORT_OF pll_0.outclk1
add_interface hps_0_hps_io conduit end
set_interface_property hps_0_hps_io EXPORT_OF ARM_A9_HPS.hps_io
add_interface memory conduit end
set_interface_property memory EXPORT_OF ARM_A9_HPS.memory
add_interface our_video_dma_0_video_data_streaming_source avalon_streaming source
set_interface_property our_video_dma_0_video_data_streaming_source EXPORT_OF our_video_dma_0.video_data_streaming_source
add_interface reset reset sink
set_interface_property reset EXPORT_OF sys_pll.ref_reset

set_interconnect_requirement {$system} qsys_mm.clockCrossingAdapter HANDSHAKE
set_interconnect_requirement {$system} qsys_mm.maxAdditionalLatency 1

save_system soc_system.qsys
